# Altium schematic sheet Sheet3.SchDoc
size A4
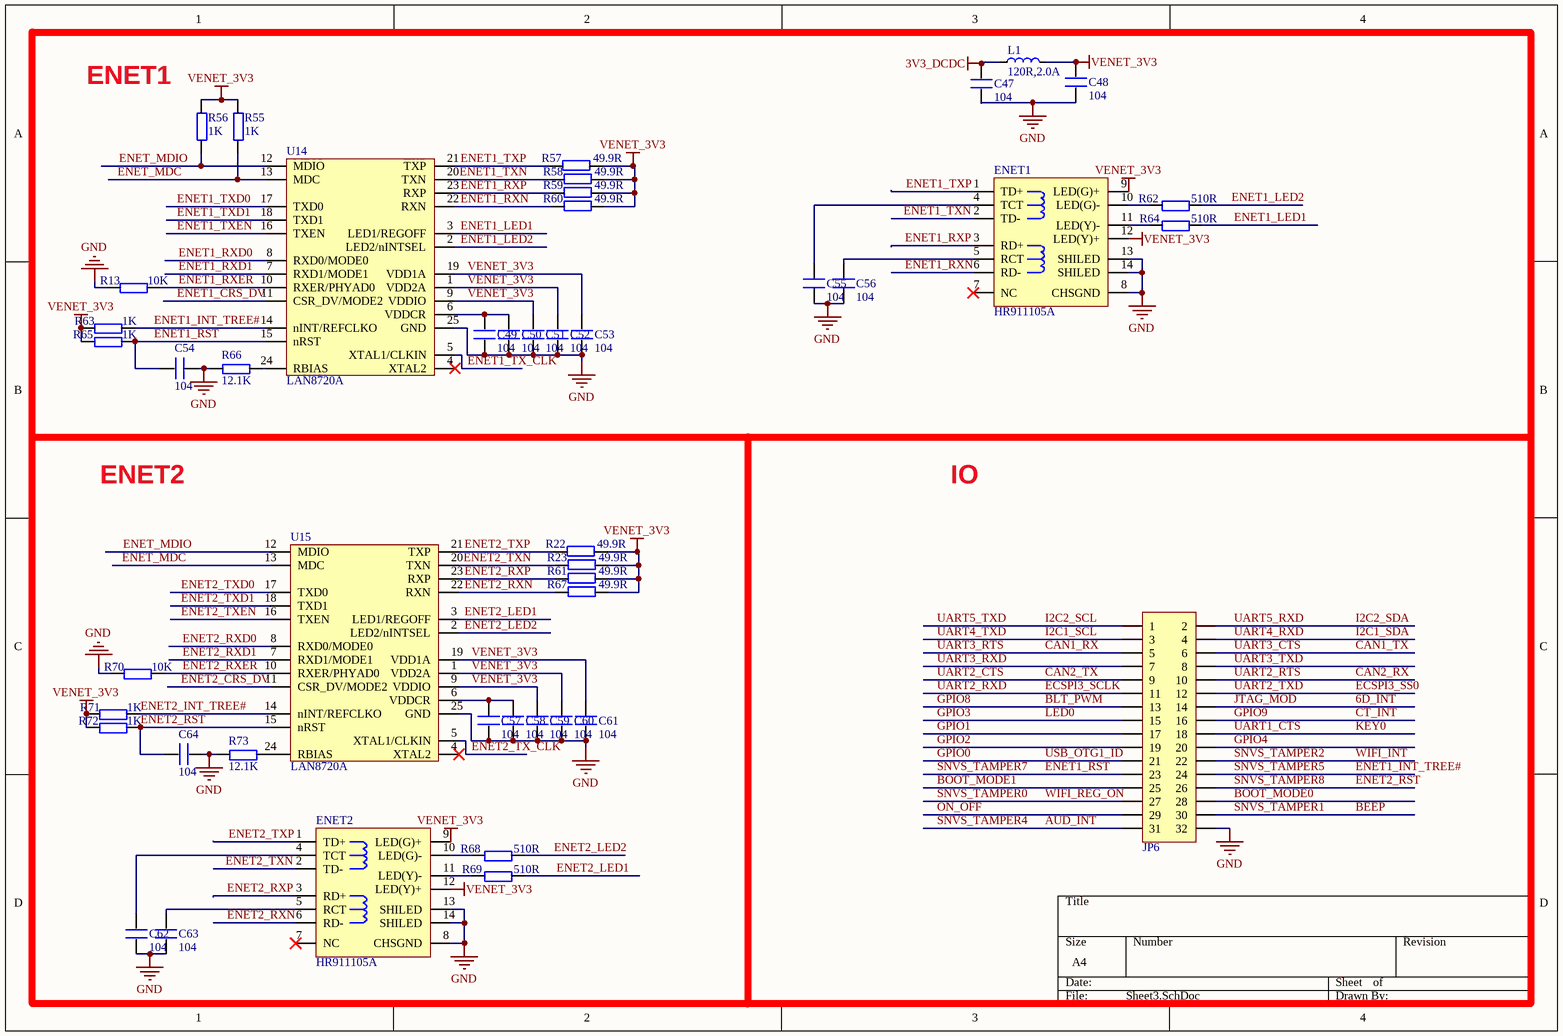
[diagram p0: Sheet3.SchDoc]

## Parts
C47  104  [C 0603]
C48  104  [C 0603]
C49  104  [C 0603]
C50  104  [C 0603]
C51  104  [C 0603]
C52  104  [C 0603]
C53  104  [C 0603]
C54  104  [C 0603]
C55  104  [C 0603]
C56  104  [C 0603]
C57  104  [C 0603]
C58  104  [C 0603]
C59  104  [C 0603]
C60  104  [C 0603]
C61  104  [C 0603]
C62  104  [C 0603]
C63  104  [C 0603]
C64  104  [C 0603]
ENET1  HR911105A  [RJ-45A12]
ENET2  HR911105A  [RJ-45A12]
JP6  Header 2X11  [HDR-16X2]  (value not drawn)
L1  120R,2.0A  [L 0603]
R13  10K  [R 0603]
R22  49.9R  [R 0603]
R23  49.9R  [R 0603]
R55  1K  [R 0603]
R56  1K  [R 0603]
R57  49.9R  [R 0603]
R58  49.9R  [R 0603]
R59  49.9R  [R 0603]
R60  49.9R  [R 0603]
R61  49.9R  [R 0603]
R62  510R  [R 0603]
R63  1K  [R 0603]
R64  510R  [R 0603]
R65  1K  [R 0603]
R66  12.1K  [R 0603]
R67  49.9R  [R 0603]
R68  510R  [R 0603]
R69  510R  [R 0603]
R70  10K  [R 0603]
R71  1K  [R 0603]
R72  1K  [R 0603]
R73  12.1K  [R 0603]
U14  LAN8720A  [QFN24]
U15  LAN8720A  [QFN24]

## Nets
3V3_DCDC: C47.2 L1.1
GND: C47.1 C48.1 C49.1 C50.1 C51.1 C52.1 C53.1 C54.1 C55.1 C56.1 C57.1 C58.1 C59.1 C60.1 C61.1 C62.1 C63.1 C64.1 ENET1.8(CHSGND) ENET1.13(SHILED) ENET1.14(SHILED) ENET2.8(CHSGND) ENET2.13(SHILED) ENET2.14(SHILED) JP6.32 R13.1 R66.1 R70.1 R73.1 U14.25(GND) U15.25(GND)
VENET_3V3: C48.2 C51.2 C52.2 C53.2 C59.2 C60.2 C61.2 ENET1.9(LED(G)+) ENET1.12(LED(Y)+) ENET2.9(LED(G)+) ENET2.12(LED(Y)+) L1.2 R22.1 R23.1 R55.2 R56.2 R57.1 R58.1 R59.1 R60.1 R61.1 R63.1 R65.1 R67.1 R71.1 R72.1 U14.1(VDD2A) U14.9(VDDIO) U14.19(VDD1A) U15.1(VDD2A) U15.9(VDDIO) U15.19(VDD1A)
6D_INT: JP6.14  [also labelled JTAG_MOD]
AUD_INT: JP6.31  [also labelled SNVS_TAMPER4]
BEEP: JP6.30  [also labelled SNVS_TAMPER1]
BLT_PWM: JP6.13  [also labelled GPIO8]
BOOT_MODE0: JP6.28
BOOT_MODE1: JP6.25
CAN1_RX: JP6.5  [also labelled UART3_RTS]
CAN1_TX: JP6.6  [also labelled UART3_CTS]
CAN2_RX: JP6.10  [also labelled UART2_RTS]
CAN2_TX: JP6.9  [also labelled UART2_CTS]
CT_INT: JP6.16  [also labelled GPIO9]
ECSPI3_SCLK: JP6.11  [also labelled UART2_RXD]
ECSPI3_SS0: JP6.12  [also labelled UART2_TXD]
ENET1_CRS_DV: U14.11(CSR_DV/MODE2)
ENET1_INT_TREE#: JP6.24 R63.2 U14.14(nINT/REFCLKO)  [also labelled SNVS_TAMPER5]
ENET1_LED1: R64.2 U14.3(LED1/REGOFF)
ENET1_LED2: R62.2 U14.2(LED2/nINTSEL)
ENET1_RST: C54.2 JP6.23 R65.2 U14.15(nRST)  [also labelled SNVS_TAMPER7]
ENET1_RXD0: U14.8(RXD0/MODE0)
ENET1_RXD1: U14.7(RXD1/MODE1)
ENET1_RXER: R13.2 U14.10(RXER/PHYAD0)
ENET1_RXN: ENET1.6(RD-) R60.2 U14.22(RXN)
ENET1_RXP: ENET1.3(RD+) R59.2 U14.23(RXP)
ENET1_TX_CLK: U14.5(XTAL1/CLKIN)
ENET1_TXD0: U14.17(TXD0)
ENET1_TXD1: U14.18(TXD1)
ENET1_TXEN: U14.16(TXEN)
ENET1_TXN: ENET1.2(TD-) R58.2 U14.20(TXN)
ENET1_TXP: ENET1.1(TD+) R57.2 U14.21(TXP)
ENET2_CRS_DV: U15.11(CSR_DV/MODE2)
ENET2_INT_TREE#: R71.2 U15.14(nINT/REFCLKO)
ENET2_LED1: R69.2 U15.3(LED1/REGOFF)
ENET2_LED2: R68.2 U15.2(LED2/nINTSEL)
ENET2_RST: C64.2 JP6.26 R72.2 U15.15(nRST)  [also labelled SNVS_TAMPER8]
ENET2_RXD0: U15.8(RXD0/MODE0)
ENET2_RXD1: U15.7(RXD1/MODE1)
ENET2_RXER: R70.2 U15.10(RXER/PHYAD0)
ENET2_RXN: ENET2.6(RD-) R67.2 U15.22(RXN)
ENET2_RXP: ENET2.3(RD+) R61.2 U15.23(RXP)
ENET2_TX_CLK: U15.5(XTAL1/CLKIN)
ENET2_TXD0: U15.17(TXD0)
ENET2_TXD1: U15.18(TXD1)
ENET2_TXEN: U15.16(TXEN)
ENET2_TXN: ENET2.2(TD-) R23.2 U15.20(TXN)
ENET2_TXP: ENET2.1(TD+) R22.2 U15.21(TXP)
ENET_MDC: R55.1 U14.13(MDC) U15.13(MDC)
ENET_MDIO: R56.1 U14.12(MDIO) U15.12(MDIO)
GPIO0: JP6.21  [also labelled USB_OTG1_ID]
GPIO1: JP6.17
GPIO2: JP6.19
GPIO3: JP6.15  [also labelled LED0]
GPIO4: JP6.20
I2C1_SCL: JP6.3  [also labelled UART4_TXD]
I2C1_SDA: JP6.4  [also labelled UART4_RXD]
I2C2_SCL: JP6.1  [also labelled UART5_TXD]
I2C2_SDA: JP6.2  [also labelled UART5_RXD]
KEY0: JP6.18  [also labelled UART1_CTS]
ON_OFF: JP6.29
SNVS_TAMPER0: JP6.27  [also labelled WIFI_REG_ON]
SNVS_TAMPER2: JP6.22  [also labelled WIFI_INT]
UART3_RXD: JP6.7
UART3_TXD: JP6.8
NetC49_2: C49.2 C50.2 U14.6(VDDCR)
NetC55_2: C55.2 ENET1.4(TCT)
NetC56_2: C56.2 ENET1.5(RCT)
NetC57_2: C57.2 C58.2 U15.6(VDDCR)
NetC62_2: C62.2 ENET2.4(TCT)
NetC63_2: C63.2 ENET2.5(RCT)
NetENET1_10: ENET1.10(LED(G)-) R62.1
NetENET1_11: ENET1.11(LED(Y)-) R64.1
NetENET2_10: ENET2.10(LED(G)-) R68.1
NetENET2_11: ENET2.11(LED(Y)-) R69.1
NetR66_2: R66.2 U14.24(RBIAS)
NetR73_2: R73.2 U15.24(RBIAS)

Not connected (* = marked no-connect by the designer): ENET1 7(NC)*; ENET2 7(NC)*; U14 4(XTAL2)*; U15 4(XTAL2)*

## Notes on the sheet
- (near R56) ENET1
- ENET2
- IO

## Library data of the parts
C47-C64 = C
ENET1 ENET2 = HR911105A: 带灯以太网接口; 版权归属: 源创客; BOM名称: 带灯以太网接口; 学习资源: www.ooocke.com
JP6 = Header 16X2: 16*2P接插件; 版权归属: 源创客; BOM名称: 16*2P接插件; 学习资源: www.ooocke.com
L1 = L: 小功率贴片电感磁珠; 版权归属: 源创客; BOM名称: 小功率贴片电感; 学习资源: www.ooocke.com
R13 R22 R23 R55-R73 = R
U14 U15 = LAN8720: ETH PHY